# Altium schematic sheet Relay Driver.SchDoc
size A; SheetNumber: 4; SheetTotal: 15
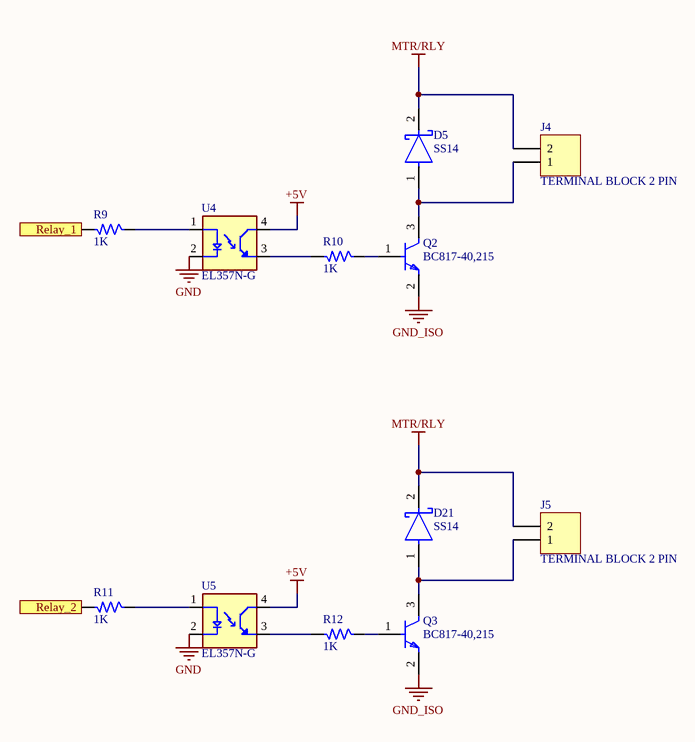
[diagram p0: Relay Driver.SchDoc]

## Parts
D5  SS14  [FP-403AE-MFG]
D21  SS14  [FP-403AE-MFG]
J4  TERMINAL BLOCK 2 PIN  [CON2_P196_1729128_TH_ST]
J5  TERMINAL BLOCK 2 PIN  [CON2_P196_1729128_TH_ST]
Q2  BC817-40,215  [FP-SOT23-IPC_A]
Q3  BC817-40,215  [FP-SOT23-IPC_A]
R9  1K  [RES_0805]
R10  1K  [RES_0805]
R11  1K  [RES_0805]
R12  1K  [RES_0805]
U4  EL357N-G  [OPTO_EL357N-G]
U5  EL357N-G  [OPTO_EL357N-G]

## Ports
Relay_1 (in, see Block Diagram[6B]), Relay_2 (in, see Block Diagram[6B])

## Nets
+5V: U4.4(CT) U5.4(CT)
GND: U4.2(C) U5.2(C)
GND_ISO: Q2.2(E) Q3.2(E)
MTR/RLY: D5.2(C) D21.2(C) J4.2 J5.2
Relay_1: R9.2 ; port Relay_1
Relay_2: R11.2 ; port Relay_2
NetD5_1: D5.1(A) J4.1 Q2.3(C)
NetD21_1: D21.1(A) J5.1 Q3.3(C)
NetQ2_1: Q2.1(B) R10.1
NetQ3_1: Q3.1(B) R12.1
NetR9_1: R9.1 U4.1(A)
NetR10_2: R10.2 U4.3(ET)
NetR11_1: R11.1 U5.1(A)
NetR12_2: R12.2 U5.3(ET)

## Library data of the parts
D5 D21 = SS14: DIODE SCHOTTKY 40V 1A SMA; Manufacturer: ON Semiconductor; Peak Reverse Current: 0.2mA; Max Junction Temp: +125°C; Standoff Height: 0.05mm; Max Surge Forward Current: 40A; Mouser Description: Schottky Diodes & Rectifiers SMA 40V 1.0A; RoHS: TRUE; Lead Free: Yes; Manufacturer Part Number: SS14; Device Class L3: Schottky Diodes; Category: Diode; Automotive: No; Digikey Description: DIODE SCHOTTKY 40V 1A SMA; ComponentLink2Description: Datasheet; Device Class L2: Diodes; Height: 2.5mm; Temperature Range High: +125°C; ComponentLink2URL: https://www.onsemi.com/pub/Collateral/SS19-D.PDF; Device Class L1: Discrete Semiconductors; Package: 403AE; Octopart: https://octopart.com/ss14-on+semiconductor-29205033; Max Repetitive Reverse Voltage: 40V; Temperature Range Low: -65°C; Forward Current: 1A; Temperature: -65°C to +125°C
J4 J5 = CON-TB_2X1-196-ST-TH: 2 Pins, 1 Row 5mm Pitch, straight Connector, male; Manufacturer: Phoenix Contact; Manufacturer Part Number: MKDSN1,5/2; Alternate Part Number-1: NA; Case/Package: TH-CON; Supplier-1: SP ROAD; Supplier Part Number-1: MKDSN1,5/2
Q2 Q3 = CMP-14406-000007-1: TRANS NPN 45V 0.5A SOT23; Manufacturer: Nexperia; Collector Emitter Saturation Voltage: 700mV; Power Dissipation: 250mW; Collector Base Voltage: 50V; Unity Gain Freq: 100MHz; Hfe Max: 600; Rthja Max: 500K/W; Emitter Base Voltage: 5V; Max Collector Current: 500mA; Hfe Testvce: 1V; Automotive Grade: Grade 0; Hfe Min: 250; Max Junction Temp: +150°C; Number Of Npn: 1; Hfe Testic: 100mA; Octopart: https://octopart.com/bc817-40%2C215-nexperia-78739081; Lead Free: Yes; Ipc Land Pattern Name: SOT95P230X100-3; Manufacturer Part Number: BC817-40,215; RoHS: TRUE; Collector Emitter Breakdown Voltage: 45V; Digikey Description: TRANS NPN 45V 0.5A SOT23; ComponentLink2URL: https://assets.nexperia.com/documents/data-sheet/BC817_SER.pdf; Temperature Range High: +150°C; Mouser Description: BC817 Series 45 V 500 mA 250 mW SMT NPN General-Purpose Transistor - SOT-23-; Device Class L3: BJTs; Temperature: to +150°C; Height: 1.1mm; Automotive: Yes; Ambient Temperature Range Low: -65°C; Package: SOT23; Collector Emitter Voltage: 45V; Category: Trans; ComponentLink2Description: Datasheet; Device Class L2: Transistors; Ambient Temperature Range High: +150°C; Number Of Elements: 1; Device Class L1: Discrete Semiconductors; Footprint Url: https://assets.nexperia.com/documents/outline-drawing/SOT23.pdf
R9-R12 = RES_1K-0.125W-1%-0805: 1 kOhms ±1% 0.125W, 1/8W Chip Resistor 0805 (2012 Metric) Moisture Resistant Thick Film; Manufacturer: Walsin; Manufacturer Part Number: WR08X1001FTL; Case/Package: 0805; Supplier-1: SP ROAD; Supplier Part Number-1: RC0805JR-071KL; Alternate Part Number-1: WR08X1001FTL
U4 U5 = EL357N-G: PHOTOTRANSISTOR PHOTOCOUPLER; Package: None; Price: None; Availability: Unavailable; MP: EL357N-G; Value: *